# EAGLE design DLOCK (EAGLE 6.3)
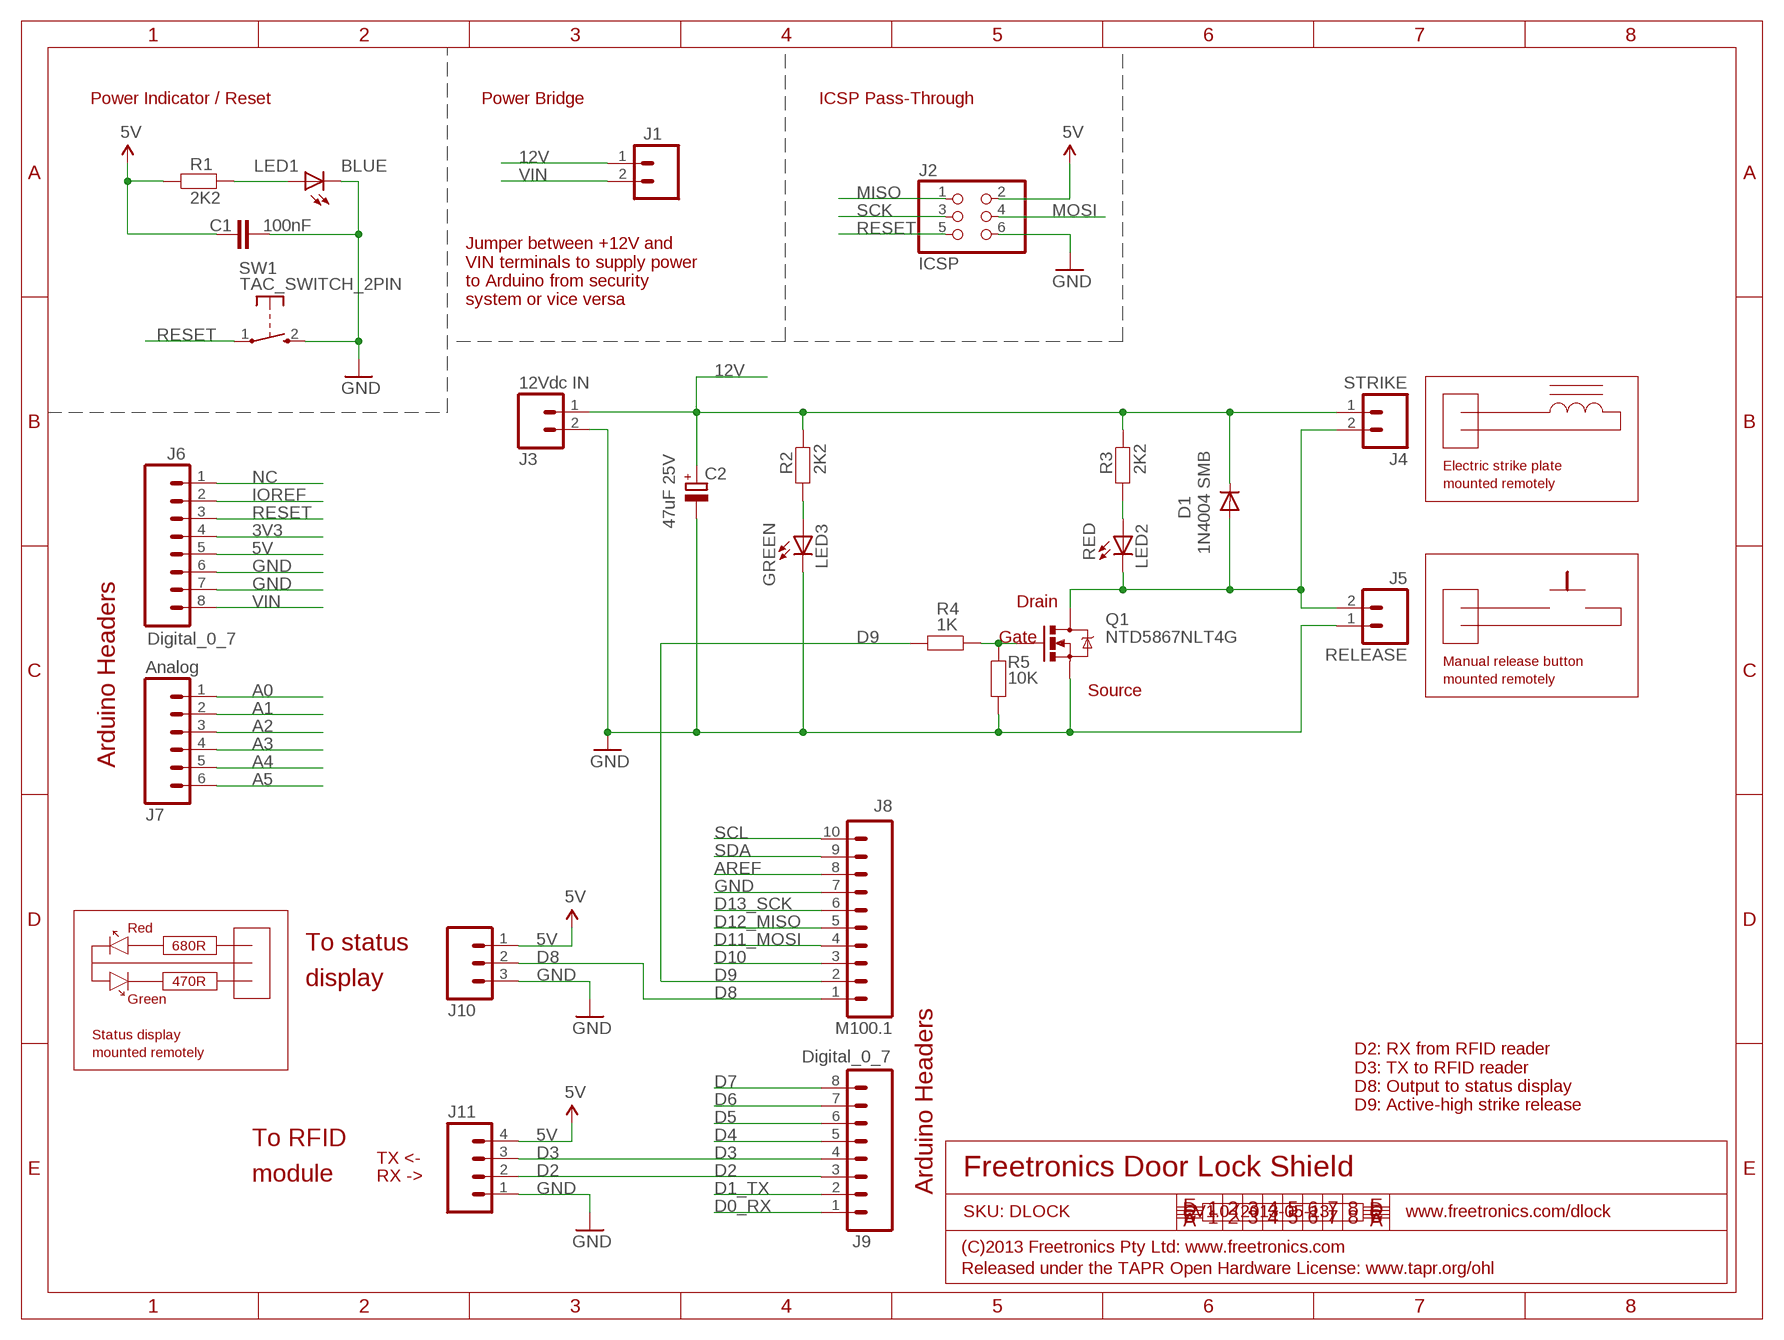
[diagram p0: schematic, sheet 1]

## Parts
C1  100nF  CAP0603  [0603]
C2  47uF 25V  CPOL-EUD  [PANASONIC_D]
D1  1N4004 SMB  DIODESMB  [SMB-DIODE]
J1  M02PTH  [1X02]
J2  ICSP  PINHD-2X3  [2X03]
J3  12Vdc IN  M023.5MM  [SCREWTERMINAL-3.5MM-2]
J4  STRIKE  M023.5MM  [SCREWTERMINAL-3.5MM-2]
J5  RELEASE  M02PTH  [1X02]
J6  Digital_0_7  M08  [1X08]
J7  Analog  M06SIP  [1X06]
J8  M100.1  [1X10]
J9  Digital_0_7  M08  [1X08]
J10  M03PTH  [1X03]
J11  M04PTH  [1X04]
LED1  BLUE  LED0603  [LED-0603]
LED2  RED  LED0603  [LED-0603]
LED3  GREEN  LED0603  [LED-0603]
Q1  NTD5867NLT4G  MOSFET-NCHANNELDPAK  [DPACK]
R1  2K2  RESISTOR0603  [0603]
R2  2K2  RESISTOR0603  [0603]
R3  2K2  RESISTOR0603  [0603]
R4  1K  RESISTOR0603  [0603]
R5  10K  RESISTOR0603  [0603]
SW1  TAC_SWITCH_2PIN  [TACTILE_SWITCH_SMD_2PIN_TINY]

## Nets
3V3: J6.4
5V: C1.1 J2.2 J6.5 J10.1 J11.4 R1.1
12V: C2.+ D1.C J1.1 J3.1 J4.1 R2.2 R3.2
A0: J7.1
A1: J7.2
A2: J7.3
A3: J7.4
A4: J7.5
A5: J7.6
AREF: J8.8
D0_RX: J9.1
D1_TX: J9.2
D2: J9.3 J11.2
D3: J9.4 J11.3
D4: J9.5
D5: J9.6
D6: J9.7
D7: J9.8
D8: J8.1 J10.2
D9: J8.2 R4.2
D10: J8.3
D11_MOSI: J8.4
D12_MISO: J8.5
D13_SCK: J8.6
GND: C1.2 C2.- J2.6 J3.2 J5.1 J6.6 J6.7 J8.7 J10.3 J11.1 LED1.C LED3.C Q1.3(S) R5.1 SW1.2(S)
IOREF: J6.2
MISO: J2.1
MOSI: J2.4
N$4: D1.A J4.2 J5.2 LED2.C Q1.2(D)
N$5: LED2.A R3.1
N$6: Q1.1(G) R4.1 R5.2
N$7: LED3.A R2.1
N$8: LED1.A R1.2
NC: J6.1
RESET: J2.5 J6.3 SW1.1(P)
SCK: J2.3
SCL: J8.10
SDA: J8.9
VIN: J1.2 J6.8

## Notes on the sheet
- Power Indicator / Reset | Power Bridge | ICSP Pass-Through
- Jumper between +12V and
  VIN terminals to supply power
  to Arduino from security
  system or vice versa
- Electric strike plate
- mounted remotely
- Drain
- Gate
- Manual release button
- mounted remotely
- Source
- Arduino Headers
- Red
- 680R | To status
- 470R | display
- Green
- Status display
- mounted remotely
- D2: RX from RFID reader
  D3: TX to RFID reader
  D8: Output to status display
  D9: Active-high strike release
- To RFID
- TX <-
- module | Freetronics Door Lock Shield
- RX ->
- Arduino Headers
- SKU: DLOCK | V1.0 (2013-05-13) | www.freetronics.com/dlock
- (C)2013 Freetronics Pty Ltd: www.freetronics.com
- Released under the TAPR Open Hardware License: www.tapr.org/ohl

## Library data of the parts
C1 = freetronics-master-v1:CAP: Capacitor Standard 0603 ceramic capacitor, and 0.1" leaded capacitor.
C2 = rcl:CPOL-EU: POLARIZED CAPACITOR, European symbol
D1 = freetronics:DIODE: Diode These are standard reverse protection diodes and small signal diodes. SMA package can handle up to about 1A. SOD-323 can handle about 200mA. What the SOD-323 package when ordering, there are some mfgs out there that are 5-pin packages.
J1 = freetronics-original:M02: Header 2 Standard 2-pin 0.1" header. Use with straight break away headers (SKU : PRT-00116), right angle break away headers (PRT-00553), swiss pins (PRT-00743), machine pins (PRT-00117), and female headers (PRT-00115). Molex polarized connector foot print use with SKU : PRT-08233 with associated crimp pins and housings.
J2 = freetronics-master-v1.1:PINHD-2X3: PIN HEADER
J3-J5 = freetronics-master-v1.1:M02: Header 2 Standard 2-pin 0.1" header. Use with straight break away headers (SKU : PRT-00116), right angle break away headers (PRT-00553), swiss pins (PRT-00743), machine pins (PRT-00117), and female headers (PRT-00115). Molex polarized connector foot print use with SKU : PRT-08233 with associated crimp pins and housings.
J6 J9 = freetronics:M08: Header 8 Standard 8-pin 0.1" header. Use with straight break away headers (SKU : PRT-00116), right angle break away headers (PRT-00553), swiss pins (PRT-00743), machine pins (PRT-00117), and female headers (PRT-00115).
J7 = freetronics:M06: Header 6 Standard 6-pin 0.1" header. Use with straight break away headers (SKU : PRT-00116), right angle break away headers (PRT-00553), swiss pins (PRT-00743), machine pins (PRT-00117), and female headers (PRT-00115). Molex polarized connector foot print use with SKU : PRT-08094 with associated crimp pins and housings. NOTES ON THE VARIANTS LOCK and LOCK_LONGPADS... This footprint was designed to help hold the alignment of a through-hole component (i.e. 6-pin header) while soldering it into place. You may notice that each hole has been shifted either up or down by 0.005 of an inch from it's more standard position (which is a perfectly straight line). This slight alteration caused the pins (the squares in the middle) to touch the edges of the holes. Because they are alternating, it causes a "brace" to hold the component in place. 0.005 has proven to be the perfect amount of "off-center" position when using our standard breakaway headers. Although looks a little odd when you look at the bare footprint, once you have a header in there, the alteration is very hard to notice. Also, if you push a header all the way into place, it is covered up entirely on the bottom side. This idea of altering the position of holes to aid alignment will be further integrated into the Sparkfun Library for other footprints. It can help hold any component with 3 or more connection pins.
J8 = freetronics-original:M10: Header 10 Standard 10-pin 0.1" header. Use with straight break away headers (SKU : PRT-00116), right angle break away headers (PRT-00553), swiss pins (PRT-00743), machine pins (PRT-00117), and female headers (PRT-00115).
J10 = freetronics-master-v1:M03: Header 3 Standard 3-pin 0.1" header. Use with straight break away headers (SKU : PRT-00116), right angle break away headers (PRT-00553), swiss pins (PRT-00743), machine pins (PRT-00117), and female headers (PRT-00115). Molex polarized connector foot print use with SKU : PRT-08232 with associated crimp pins and housings.
J11 = freetronics-master-v1:M04: Header 4 Standard 4-pin 0.1" header. Use with straight break away headers (SKU : PRT-00116), right angle break away headers (PRT-00553), swiss pins (PRT-00743), machine pins (PRT-00117), and female headers (PRT-00115). Molex polarized connector foot print use with SKU : PRT-08231 with associated crimp pins and housings.
LED1-LED3 = freetronics-jon:LED: LEDs Standard schematic elements and footprints for 5mm, 3mm, 1206, and 0603 sized LEDs. 5mm - Spark Fun Electronics SKU : COM-00529 (and others)
Q1 = freetronics-master-v1.1:MOSFET-NCHANNEL
R1-R3 = freetronics-jon:RESISTOR: Resistor Basic schematic elements and footprints for 0603, 1206, and PTH 1/10th watt (small) resistors.
R4 R5 = freetronics-master-v1:RESISTOR: Resistor Basic schematic elements and footprints for 0603, 1206, and PTH 1/10th watt (small) resistors.
SW1 = freetronics-master-v1.1:TAC_SWITCH_2PIN: Momentary Tactile Switch - 2 pin

## Board
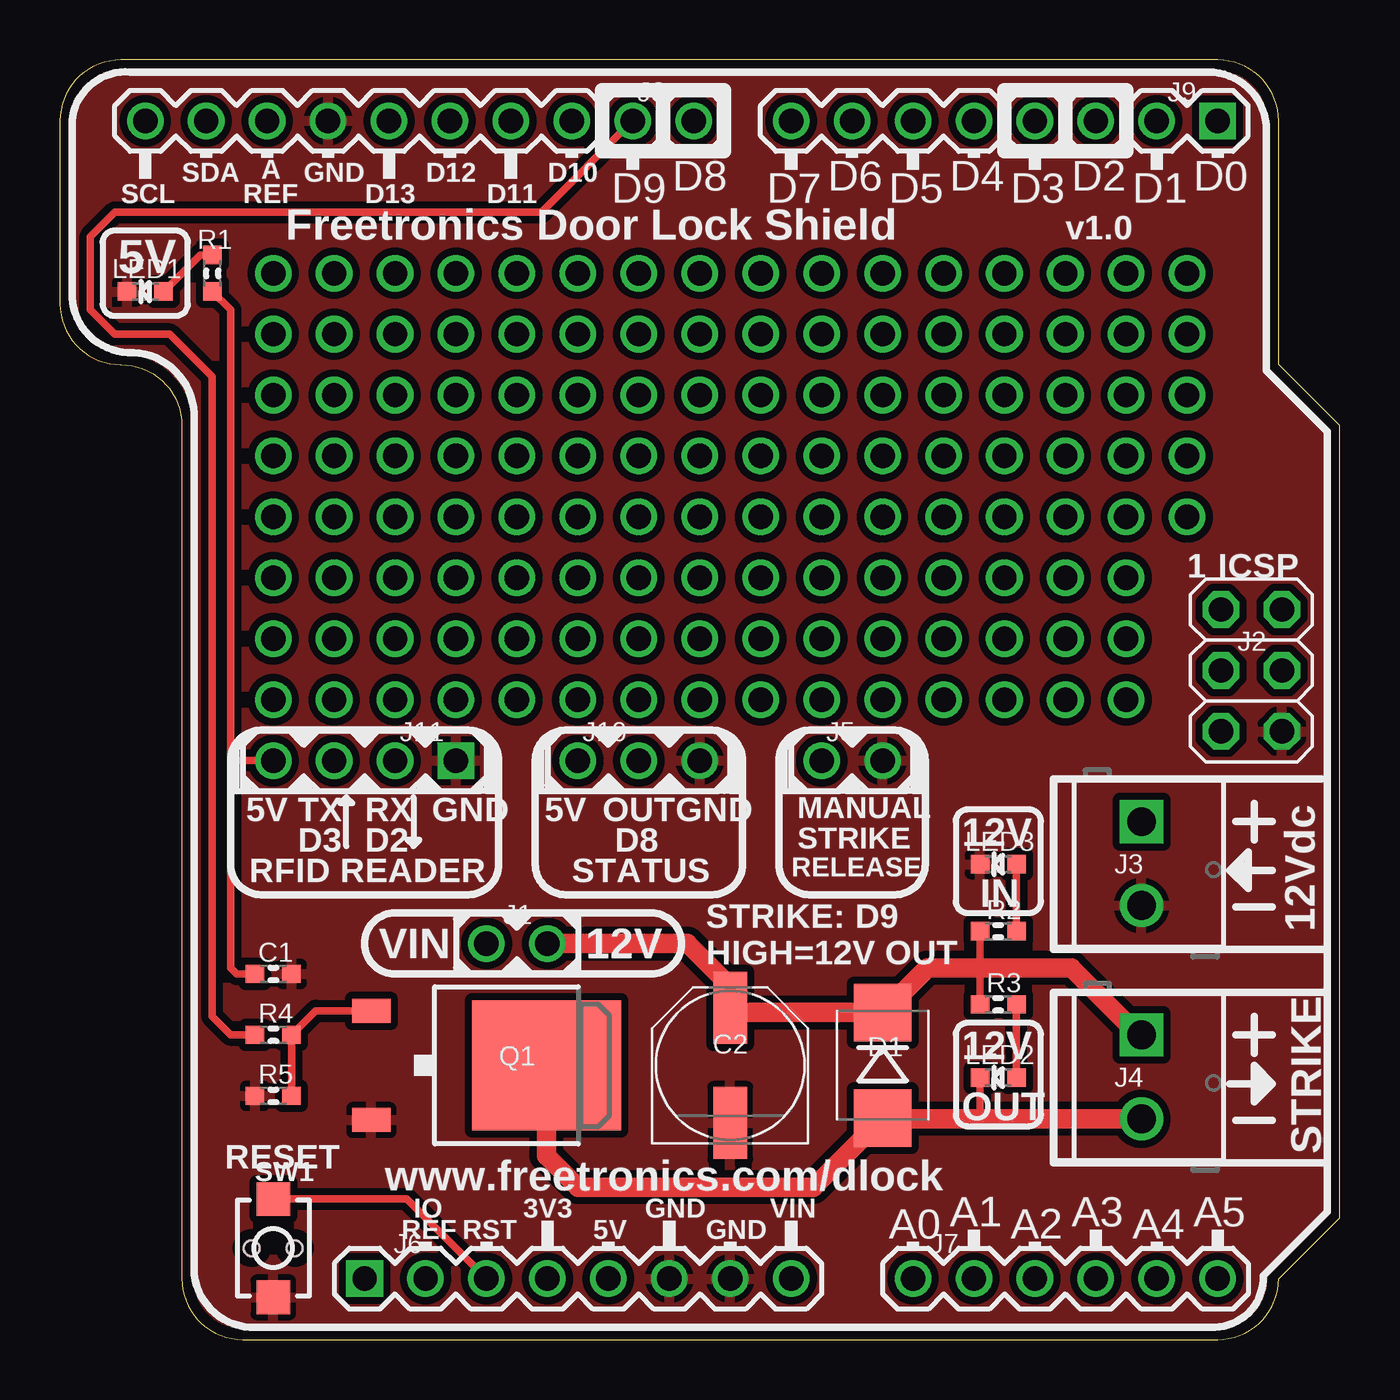
[diagram p1: board, top side]
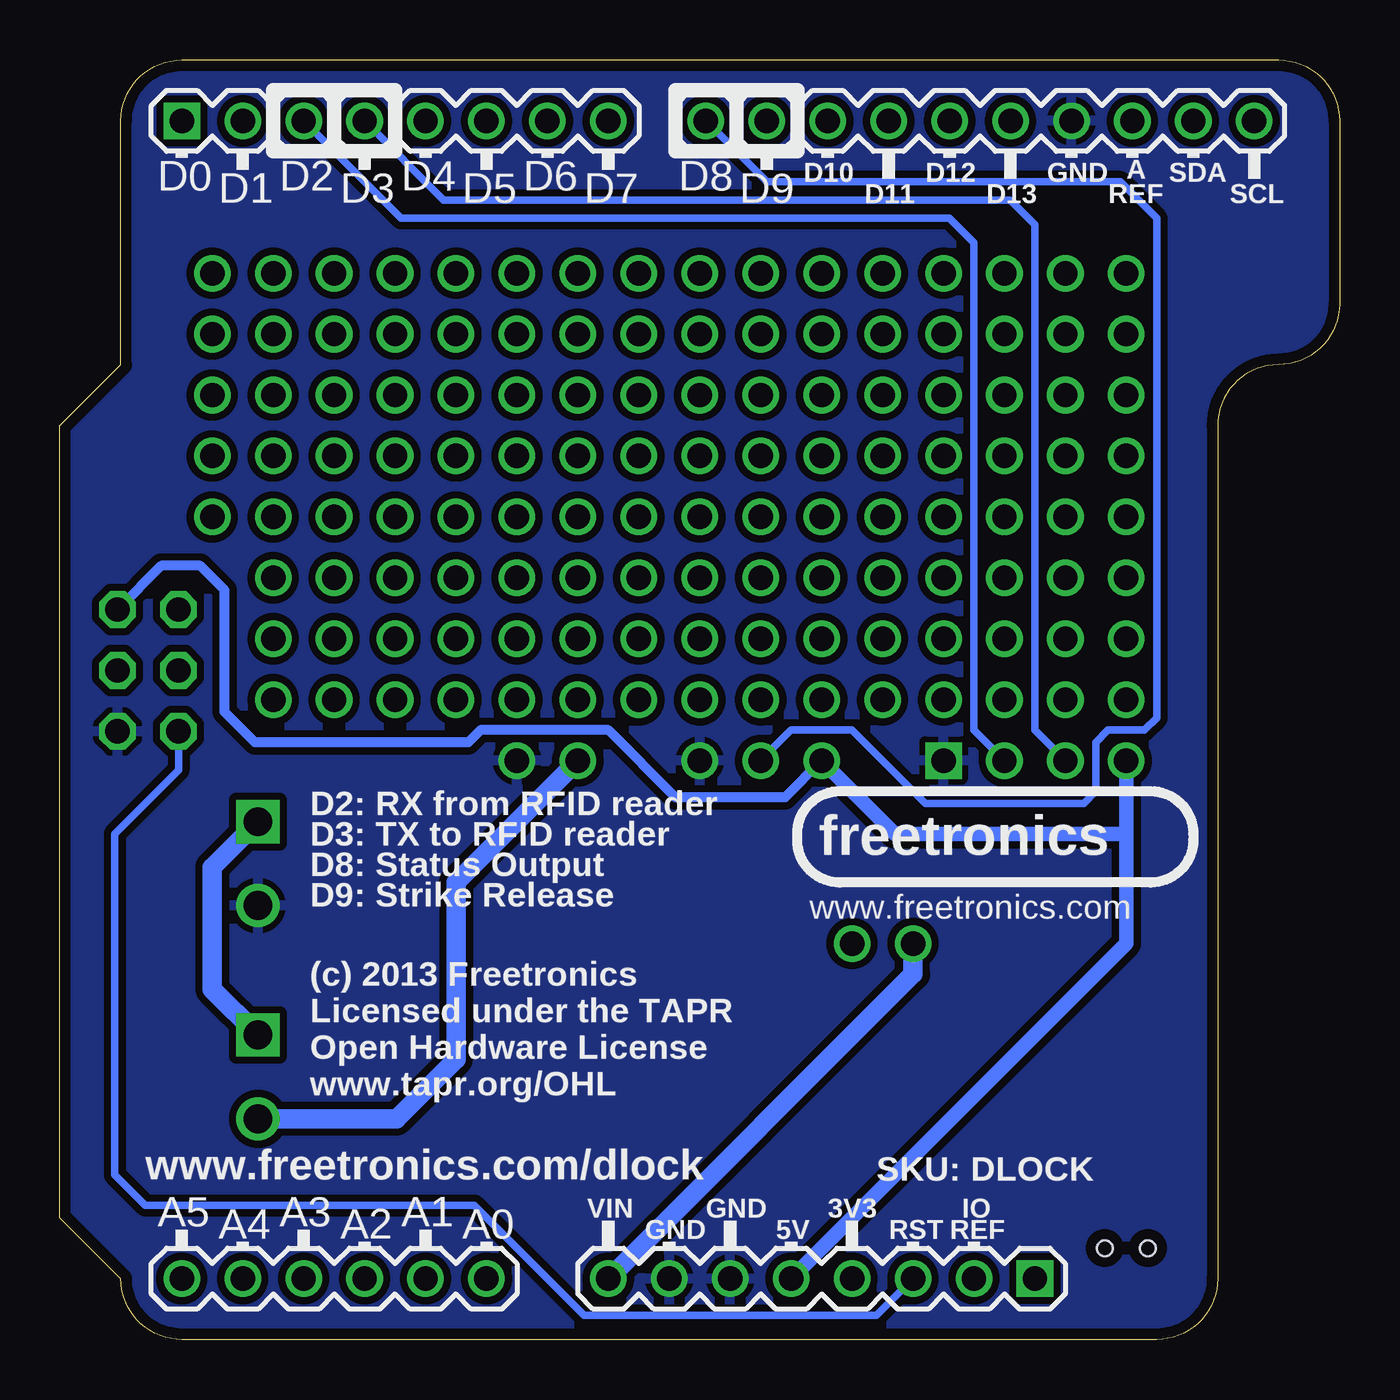
[diagram p2: board, bottom side, seen from below]

Size 53.34 x 53.34 mm. Coordinates in mm from the lower left corner, seen from the top.
Outline: 5.08,2.54 arc90 7.62,0 48.26,0 arc90 50.8,2.54 53.34,5.08 53.34,38.1 50.8,40.64 50.8,50.8 arc90 48.26,53.34 2.54,53.34 arc90 0,50.8 0,43.18 arc90 2.54,40.64 arc-90 5.08,38.1 5.08,2.54
Copper layers (1*16): Top 0.035mm / dielectric 1.5mm / Bottom 0.035mm
Design rules "default *": minimum track width 10mil, minimum drill 24mil, track to track 12mil, track to pad 12mil, pad to pad 12mil, via to via 12mil, smd to smd 8mil, copper to edge 18mil, drill to drill 8mil, minimum pad ring 10mil, minimum via ring 8mil, stop-mask expansion 4mil, vias tented up to drill 0mil, thermal gap 10mil

### Footprints (pad centres in the part's own frame; a part is rotated, then mirrored left to right if it is on the bottom)
0603 = smd 0.762 x 0.762: 1 -0.762,0; 2 0.762,0
PANASONIC_D = smd 3 x 1.4: + 2.4,0; - -2.4,0
SMB-DIODE = smd 2.4 x 2.4: A 2.2,0; C -2.2,0
1X02 = drill 1.016: 1 0,0; 2 2.54,0
2X03 = drill 1.016 octagon: 1 -2.54,-1.27; 2 -2.54,1.27; 3 0,-1.27; 4 0,1.27; 5 2.54,-1.27; 6 2.54,1.27
SCREWTERMINAL-3.5MM-2 = drill 1.2 square: 1 0,0 | drill 1.2: 2 3.5,0
1X08 = drill 1.016 square: 1 0,0 | drill 1.016: 2 2.54,0; 3 5.08,0; 4 7.62,0; 5 10.16,0; 6 12.7,0; 7 15.24,0; 8 17.78,0
1X06 = drill 1.016: 1 0,0; 2 2.54,0; 3 5.08,0; 4 7.62,0; 5 10.16,0; 6 12.7,0
1X10 = drill 1.016: 1 0,0; 2 2.54,0; 3 5.08,0; 4 7.62,0; 5 10.16,0; 6 12.7,0; 7 15.24,0; 8 17.78,0; 9 20.32,0; 10 22.86,0
1X03 = drill 1.016: 1 0,0; 2 2.54,0; 3 5.08,0
1X04 = drill 1.016 square: 1 0,0 | drill 1.016: 2 2.54,0; 3 5.08,0; 4 7.62,0
LED-0603 = smd 0.762 x 0.762: A -0.762,0; C 0.762,0
DPACK = smd 1 x 1.6: 1 -2.28,-4.8; 3 2.28,-4.8 | smd 5.4 x 6.2: 2 0,2.5
TACTILE_SWITCH_SMD_2PIN_TINY = smd 1.4 x 1.4: 1 -2.05,0; 2 2.05,0 | hole 0.65: 0,0.9; 0,-0.9

### Placement (x,y rotation side)
C1  8.89,15.24 0 top
C2  27.94,11.43 90 top
D1  34.29,11.43 270 top
J1  20.32,16.51 180 top
J2  49.67,27.89 270 top
J3  45.09,21.59 270 top
J4  45.09,12.7 270 top
J5  34.29,24.13 180 top
J6  12.7,2.54 0 top
J7  35.56,2.54 0 top
J8  26.42,50.8 180 top
J9  48.26,50.8 180 top
J10  21.59,24.13 0 top
J11  16.51,24.13 180 top
LED1  3.56,43.69 180 top
LED2  39.12,10.92 180 top
LED3  39.12,19.81 180 top
Q1  17.78,11.43 270 top
R1  6.35,44.45 90 top
R2  39.12,17.02 180 top
R3  39.12,13.97 180 top
R4  8.89,12.7 180 top
R5  8.89,10.16 0 top
SW1  8.89,3.81 270 top

### Tracks (layer width: path | path; a pad name or v marks a point on that pad's centre or on a via)
5V
  Top 0.305: C1.1 7.37,15.24 7.11,15.49 7.11,24.13 | 7.11,24.13 7.11,42.93 R1.1 | J11.4 7.11,24.13
  Bottom 0.406: J10.1 23.11,22.61 27.69,22.61 30.48,25.4 35.81,25.4 36.32,24.89 45.21,24.89 46.48,26.16 46.48,31.24 47.5,32.26 49.11,32.26 J2.2
  Bottom 0.61: J6.5 8.89,16.51 8.89,21.08 | 8.89,21.08 J11.4 | J10.1 18.54,21.08 8.89,21.08
12V
  Top 0.305: R2.2 38.35,15.49 R3.2
  Top 0.61: J4.1 44.96,12.7
  Top 0.813: 44.96,12.7 42.16,15.49 38.35,15.49 36.15,15.49 D1.C 28.14,13.63 C2.+ 27.94,14.73 26.16,16.51 J1.1
  Bottom 0.813: J3.1 46.99,19.68 46.99,14.61 J4.1
D2
  Bottom 0.305: J9.3 39.12,46.74 16.26,46.74 15.24,45.72 15.24,25.4 J11.2
D3
  Bottom 0.305: J9.4 37.34,47.5 13.72,47.5 12.7,46.48 12.7,25.4 J11.3
D8
  Bottom 0.305: J10.2 22.86,25.4 20.32,25.4 17.27,22.35 10.67,22.35 10.16,22.86 10.16,24.89 9.65,25.4 8.13,25.4 7.62,25.91 7.62,46.74 9.14,48.26 23.88,48.26 J8.1
D9
  Top 0.305: R4.2 7.11,12.7 6.35,13.46 6.35,40.13 4.57,41.91 2.29,41.91 1.27,42.93 1.27,45.97 2.29,46.99 20.07,46.99 J8.2
GND
  pour Bottom: 0,50.8 arc-74 2.54,53.34 48.26,53.34 arc-74 50.8,50.8 50.8,40.64 53.34,38.1 53.34,5.08 50.8,2.54 arc-74 48.26,0 7.62,0 arc-74 5.08,2.54 5.08,38.1 arc90 2.54,40.64 arc-90 0,43.18
  pour Top: 0,50.8 arc-74 2.54,53.34 48.26,53.34 arc-74 50.8,50.8 50.8,40.64 53.34,38.1 53.34,5.08 50.8,2.54 arc-74 48.26,0 7.62,0 arc-74 5.08,2.54 5.08,38.1 arc90 2.54,40.64 arc-90 0,43.18
N$1  (via drill 1.02)
  other vias: 46.99,44.45
N$2  (via drill 1.02)
  other vias: 46.99,41.91
N$3  (via drill 1.02)
  other vias: 46.99,39.37
N$4
  Top 0.305: LED2.C 38.35,9.2
  Top 0.813: J4.2 38.35,9.2 34.32,9.2 D1.A 31.41,6.35 21.59,6.35 20.28,7.66 Q1.2
  Bottom 0.813: J5.2 36.83,19.05 36.83,11.68 39.31,9.2 J4.2
N$5
  Top 0.305: LED2.A R3.1
N$6
  Top 0.305: R5.2 R4.1 10.66,13.71 Q1.1
N$7
  Top 0.305: LED3.A R2.1
N$8
  Top 0.305: R1.2 5.84,45.21 LED1.A
N$9  (via drill 1.02)
  other vias: 46.99,36.83
N$10  (via drill 1.02)
  other vias: 46.99,34.29
N$11  (via drill 1.02)
  other vias: 44.45,34.29
N$12  (via drill 1.02)
  other vias: 44.45,36.83
N$13  (via drill 1.02)
  other vias: 44.45,39.37
N$14  (via drill 1.02)
  other vias: 44.45,41.91
N$15  (via drill 1.02)
  other vias: 44.45,44.45
N$16  (via drill 1.02)
  other vias: 41.91,44.45
N$17  (via drill 1.02)
  other vias: 41.91,41.91
N$18  (via drill 1.02)
  other vias: 41.91,39.37
N$19  (via drill 1.02)
  other vias: 41.91,36.83
N$20  (via drill 1.02)
  other vias: 41.91,34.29
N$21  (via drill 1.02)
  other vias: 39.37,34.29
N$22  (via drill 1.02)
  other vias: 39.37,36.83
N$23  (via drill 1.02)
  other vias: 39.37,39.37
N$24  (via drill 1.02)
  other vias: 39.37,41.91
N$25  (via drill 1.02)
  other vias: 39.37,44.45
N$26  (via drill 1.02)
  other vias: 36.83,44.45
N$27  (via drill 1.02)
  other vias: 36.83,41.91
N$28  (via drill 1.02)
  other vias: 36.83,39.37
N$29  (via drill 1.02)
  other vias: 36.83,36.83
N$30  (via drill 1.02)
  other vias: 36.83,34.29
N$31  (via drill 1.02)
  other vias: 34.29,44.45
N$32  (via drill 1.02)
  other vias: 34.29,41.91
N$33  (via drill 1.02)
  other vias: 34.29,39.37
N$34  (via drill 1.02)
  other vias: 34.29,36.83
N$35  (via drill 1.02)
  other vias: 34.29,34.29
N$36  (via drill 1.02)
  other vias: 31.75,34.29
N$37  (via drill 1.02)
  other vias: 31.75,36.83
N$38  (via drill 1.02)
  other vias: 31.75,39.37
N$39  (via drill 1.02)
  other vias: 31.75,41.91
N$40  (via drill 1.02)
  other vias: 31.75,44.45
N$41  (via drill 1.02)
  other vias: 29.21,44.45
N$42  (via drill 1.02)
  other vias: 29.21,41.91
N$43  (via drill 1.02)
  other vias: 29.21,39.37
N$44  (via drill 1.02)
  other vias: 29.21,36.83
N$45  (via drill 1.02)
  other vias: 29.21,34.29
N$46  (via drill 1.02)
  other vias: 26.67,34.29
N$47  (via drill 1.02)
  other vias: 26.67,36.83
N$48  (via drill 1.02)
  other vias: 26.67,39.37
N$49  (via drill 1.02)
  other vias: 26.67,41.91
N$50  (via drill 1.02)
  other vias: 26.67,44.45
N$51  (via drill 1.02)
  other vias: 24.13,44.45
N$52  (via drill 1.02)
  other vias: 24.13,41.91
N$53  (via drill 1.02)
  other vias: 24.13,39.37
N$54  (via drill 1.02)
  other vias: 24.13,36.83
N$55  (via drill 1.02)
  other vias: 24.13,34.29
N$56  (via drill 1.02)
  other vias: 21.59,44.45
N$57  (via drill 1.02)
  other vias: 21.59,41.91
N$58  (via drill 1.02)
  other vias: 21.59,39.37
N$59  (via drill 1.02)
  other vias: 21.59,36.83
N$60  (via drill 1.02)
  other vias: 21.59,34.29
N$61  (via drill 1.02)
  other vias: 19.05,34.29
N$62  (via drill 1.02)
  other vias: 19.05,36.83
N$63  (via drill 1.02)
  other vias: 19.05,39.37
N$64  (via drill 1.02)
  other vias: 19.05,41.91
N$65  (via drill 1.02)
  other vias: 19.05,44.45
N$66  (via drill 1.02)
  other vias: 16.51,44.45
N$67  (via drill 1.02)
  other vias: 16.51,41.91
N$68  (via drill 1.02)
  other vias: 16.51,39.37
N$69  (via drill 1.02)
  other vias: 16.51,36.83
N$70  (via drill 1.02)
  other vias: 16.51,34.29
N$71  (via drill 1.02)
  other vias: 13.97,34.29
N$72  (via drill 1.02)
  other vias: 13.97,36.83
N$73  (via drill 1.02)
  other vias: 13.97,39.37
N$74  (via drill 1.02)
  other vias: 13.97,41.91
N$75  (via drill 1.02)
  other vias: 13.97,44.45
N$76  (via drill 1.02)
  other vias: 11.43,44.45
N$77  (via drill 1.02)
  other vias: 11.43,41.91
N$78  (via drill 1.02)
  other vias: 11.43,39.37
N$79  (via drill 1.02)
  other vias: 11.43,36.83
N$80  (via drill 1.02)
  other vias: 11.43,34.29
N$81  (via drill 1.02)
  other vias: 8.89,44.45
N$82  (via drill 1.02)
  other vias: 8.89,41.91
N$83  (via drill 1.02)
  other vias: 8.89,39.37
N$84  (via drill 1.02)
  other vias: 8.89,36.83
N$85  (via drill 1.02)
  other vias: 8.89,34.29
N$86  (via drill 1.02)
  other vias: 44.45,31.75
N$87  (via drill 1.02)
  other vias: 44.45,29.21
N$88  (via drill 1.02)
  other vias: 44.45,26.67
N$89  (via drill 1.02)
  other vias: 41.91,31.75
N$90  (via drill 1.02)
  other vias: 41.91,29.21
N$91  (via drill 1.02)
  other vias: 41.91,26.67
N$92  (via drill 1.02)
  other vias: 39.37,26.67
N$93  (via drill 1.02)
  other vias: 39.37,29.21
N$94  (via drill 1.02)
  other vias: 39.37,31.75
N$95  (via drill 1.02)
  other vias: 36.83,31.75
N$96  (via drill 1.02)
  other vias: 36.83,29.21
N$97  (via drill 1.02)
  other vias: 36.83,26.67
N$98  (via drill 1.02)
  other vias: 34.29,31.75
N$99  (via drill 1.02)
  other vias: 34.29,29.21
N$100  (via drill 1.02)
  other vias: 34.29,26.67
N$101  (via drill 1.02)
  other vias: 31.75,26.67
N$102  (via drill 1.02)
  other vias: 31.75,29.21
N$103  (via drill 1.02)
  other vias: 31.75,31.75
N$104  (via drill 1.02)
  other vias: 29.21,31.75
N$105  (via drill 1.02)
  other vias: 29.21,29.21
N$106  (via drill 1.02)
  other vias: 29.21,26.67
N$107  (via drill 1.02)
  other vias: 26.67,26.67
N$108  (via drill 1.02)
  other vias: 26.67,29.21
N$109  (via drill 1.02)
  other vias: 26.67,31.75
N$110  (via drill 1.02)
  other vias: 24.13,31.75
N$111  (via drill 1.02)
  other vias: 24.13,29.21
N$112  (via drill 1.02)
  other vias: 24.13,26.67
N$113  (via drill 1.02)
  other vias: 21.59,31.75
N$114  (via drill 1.02)
  other vias: 21.59,29.21
N$115  (via drill 1.02)
  other vias: 21.59,26.67
N$116  (via drill 1.02)
  other vias: 19.05,26.67
N$117  (via drill 1.02)
  other vias: 19.05,29.21
N$118  (via drill 1.02)
  other vias: 19.05,31.75
N$119  (via drill 1.02)
  other vias: 16.51,31.75
N$120  (via drill 1.02)
  other vias: 16.51,29.21
N$121  (via drill 1.02)
  other vias: 16.51,26.67
N$122  (via drill 1.02)
  other vias: 13.97,26.67
N$123  (via drill 1.02)
  other vias: 13.97,29.21
N$124  (via drill 1.02)
  other vias: 13.97,31.75
N$125  (via drill 1.02)
  other vias: 11.43,31.75
N$126  (via drill 1.02)
  other vias: 11.43,29.21
N$127  (via drill 1.02)
  other vias: 11.43,26.67
N$128  (via drill 1.02)
  other vias: 8.89,31.75
N$129  (via drill 1.02)
  other vias: 8.89,29.21
N$130  (via drill 1.02)
  other vias: 8.89,26.67
RESET
  Top 0.305: SW1.1 14.46,5.86 J6.3
  Bottom 0.305: J2.5 48.4,23.74 51.05,21.08 51.05,6.86 49.78,5.59 36.07,5.59 31.5,1.02 19.3,1.02 J6.3
VIN
  Bottom 0.813: J6.8 17.78,15.24 J1.2

### Text on the board
tPlace: SDA | A | GND | D12 | D10 | D8 | D6 | D4 | D2 | D0 | SCL | REF | D13 | D11 | D9 | D7 | D5 | D3 | D1 | Freetronics Door Lock Shield | v1.0 | 5V | 1 | ICSP | 5V | TX | RX | GND | 5V | OUT | GND | MANUAL | 12V | D3 | D2 | D8 | STRIKE | RFID READER | STATUS | RELEASE | IN | 12Vdc | VIN | 12V | STRIKE: D9 / HIGH=12V OUT | 12V | OUT | STRIKE | RESET | www.freetronics.com/dlock | IO | 3V3 | GND | VIN | A1 | A3 | A5 | REF | RST | 5V | GND | A0 | A2 | A4
bPlace: SDA | A | GND | D12 | D10 | D8 | D6 | D4 | D2 | D0 | SCL | REF | D13 | D11 | D9 | D7 | D5 | D3 | D1 | D2: RX from RFID reader | D3: TX to RFID reader | freetronics | D8: Status Output | www.freetronics.com | D9: Strike Release | (c) 2013 Freetronics | Licensed under the TAPR | Open Hardware License | www.tapr.org/OHL | SKU: DLOCK | www.freetronics.com/dlock | IO | 3V3 | GND | VIN | A1 | A3 | A5 | REF | RST | 5V | GND | A0 | A2 | A4
tNames: SW1
tDocu: K | A | K | A | K | A